# EAGLE design Power Supply Board (EAGLE 9.6.2)
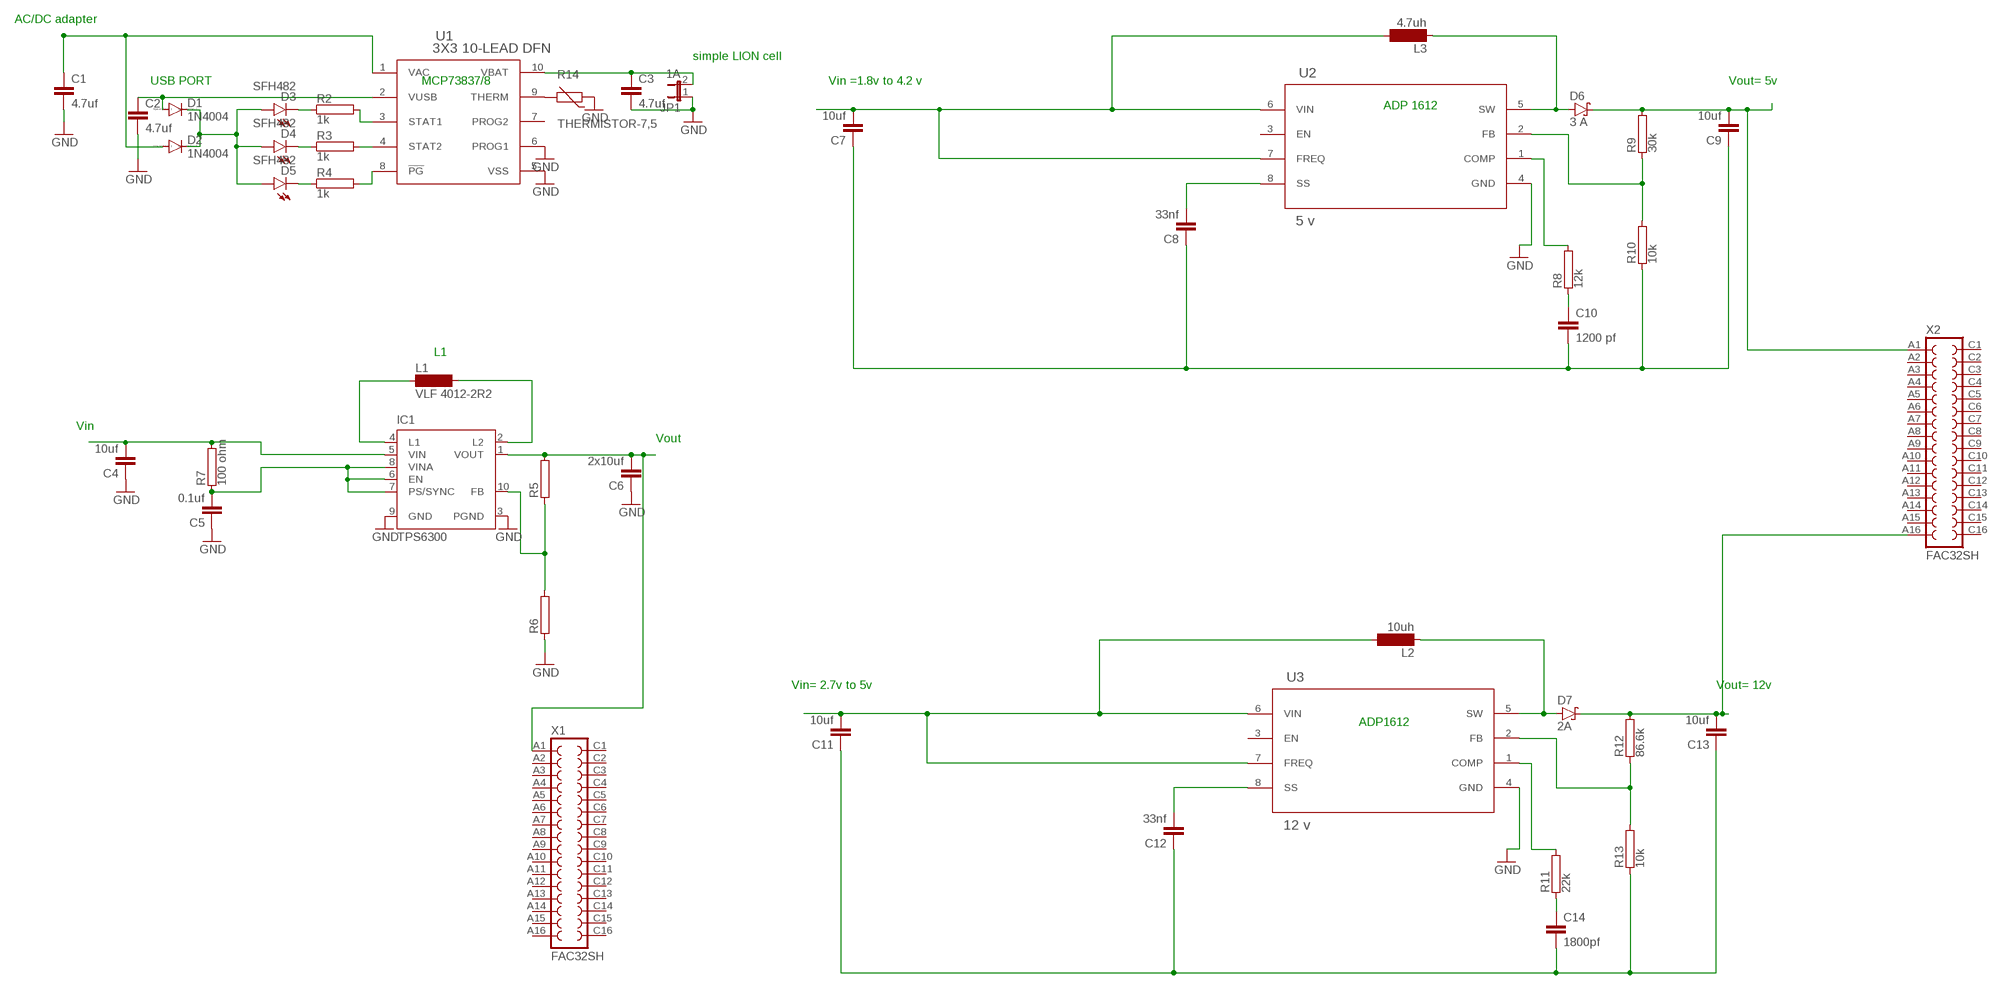
[diagram p0: schematic, sheet 1]

## Parts
C1  4.7uf  C2,5-3  [C2.5-3]
C2  4.7uf  C2,5-3  [C2.5-3]
C3  4.7uf  C2,5-3  [C2.5-3]
C4  10uf  C2,5-3  [C2.5-3]
C5  0.1uf  C2,5-3  [C2.5-3]
C6  2x10uf  C2,5-3  [C2.5-3]
C7  10uf  C2,5-3  [C2.5-3]
C8  33nf  C2,5-3  [C2.5-3]
C9  10uf  C2,5-3  [C2.5-3]
C10  1200 pf  C2,5-3  [C2.5-3]
C11  10uf  C2,5-3  [C2.5-3]
C12  33nf  C2,5-3  [C2.5-3]
C13  10uf  C2,5-3  [C2.5-3]
C14  1800pf  C2,5-3  [C2.5-3]
D1  1N4004  [DO41-10]
D2  1N4004  [DO41-10]
D3  SFH482  [SFH482]
D4  SFH482  [SFH482]
D5  SFH482  [SFH482]
D6  3 A  1N5908  [C4111-15]
D7  2A  1N5908  [C4111-15]
IC1  TPS6300  [DRC-S-PVSON-N10]
JP1  1A  JP1E  [JP1]
L1  VLF 4012-2R2  MS85  [MS85]
L2  10uh  MS42  [MS42]
L3  4.7uh  MS42  [MS42]
R2  1k  RAC01  [AC01]
R3  1k  RAC01  [AC01]
R4  1k  RAC01  [AC01]
R5  RAC01  [AC01]
R6  RAC01  [AC01]
R7  100 ohm  RAC01  [AC01]
R8  12k  RAC01  [AC01]
R9  30k  RAC01  [AC01]
R10  10k  RAC01  [AC01]
R11  22k  RAC01  [AC01]
R12  86.6k  RAC01  [AC01]
R13  10k  RAC01  [AC01]
R14  THERMISTOR-7,5  [R-7,5]
U1  3X3 10-LEAD DFN  MCP73837-FCI/UN  [MSOP10_MC_MCH]
U2  5 v  ADP1612  [RM_8_ADI]
U3  12 v  ADP1612  [RM_8_ADI]
X1  FAC32SH  [FAC32SH]
X2  FAC32SH  [FAC32SH]

## Nets
GND: C1.2 C2.2 C3.2 C4.1 C5.1 C6.1 IC1.3(PGND) IC1.9(GND) JP1.1 R6.1 R14.1 U1.5(VSS) U1.6(PROG1) U2.4(GND) U3.4(GND)
N$1: R14.2 U1.9(THERM)
N$2: C1.1 D2.A U1.1(VAC)
N$3: C2.1 D1.A U1.2(VUSB)
N$4: D1.C D2.C D3.A D4.A D5.A
N$5: C5.2 IC1.6(EN) IC1.7(PS/SYNC) IC1.8(VINA) R7.1
N$6: D3.K(C) R2.1
N$7: D4.K(C) R3.1
N$8: D5.K(C) R4.1
N$9: R2.2 U1.3(STAT1)
N$10: R3.2 U1.4(STAT2)
N$11: R4.2 U1.8(!PG)
N$12: C3.1 JP1.2 U1.10(VBAT)
N$13: C4.2 IC1.5(VIN) R7.2
N$14: IC1.4(L1) L1.1
N$15: IC1.2(L2) L1.2
N$16: C6.2 IC1.1(VOUT) R5.2 X1.A1
N$17: IC1.10(FB) R5.1 R6.2
N$18: C7.2 L3.2 U2.6(VIN) U2.7(FREQ)
N$19: D6.A L3.1 U2.5(SW)
N$20: C9.2 D6.C R9.2 X2.A1
N$21: R9.1 R10.2 U2.2(FB)
N$23: R8.2 U2.1(COMP)
N$24: C8.2 U2.8(SS)
N$25: C7.1 C8.1 C9.1 C10.2 R10.1
N$27: C10.1 R8.1
N$28: C11.2 L2.2 U3.6(VIN) U3.7(FREQ)
N$29: D7.A L2.1 U3.5(SW)
N$30: C13.2 D7.C R12.2 X2.A16
N$31: R12.1 R13.2 U3.2(FB)
N$32: R11.2 U3.1(COMP)
N$33: C12.2 U3.8(SS)
N$34: C11.1 C12.1 C13.1 C14.2 R13.1
N$35: C14.1 R11.1
Unconnected: IC1.TH U1.7(PROG2) U2.3(EN) U3.3(EN) X1.A2 X1.A3 X1.A4 X1.A5 X1.A6 X1.A7 X1.A8 X1.A9 X1.A10 X1.A11 X1.A12 X1.A13 X1.A14 X1.A15 X1.A16 X1.C1 X1.C2 X1.C3 X1.C4 X1.C5 X1.C6 X1.C7 X1.C8 X1.C9 X1.C10 X1.C11 X1.C12 X1.C13 X1.C14 X1.C15 X1.C16 X2.A2 X2.A3 X2.A4 X2.A5 X2.A6 X2.A7 X2.A8 X2.A9 X2.A10 X2.A11 X2.A12 X2.A13 X2.A14 X2.A15 X2.C1 X2.C2 X2.C3 X2.C4 X2.C5 X2.C6 X2.C7 X2.C8 X2.C9 X2.C10 X2.C11 X2.C12 X2.C13 X2.C14 X2.C15 X2.C16

## Notes on the sheet
- AC/DC adapter
- simple LION cell
- USB PORT | MCP73837/8 | Vin =1.8v to 4.2 v | Vout= 5v
- ADP 1612
- L1
- Vin
- Vout
- Vin= 2.7v to 5v | Vout= 12v
- ADP1612

## Library data of the parts
C1-C14 = capacitor-wima:C: CAPACITOR naming: grid - package width
D1 D2 = diode:1N4004: DIODE general purpose rectifier, 1 A
D3-D5 = led:SFH482: IR LED infrared emitting diode, Infineon
D6 D7 = diode:1N5908: DIODE schottky
IC1 = texas:TPS6300*: HIGH EFFICIENT SINGLE INDUCTOR BUCK-BOOST CONVERTER WITH 1.8-A SWITCHES Source: http://focus.ti.com/lit/ds/symlink/tps63001.pdf; MPN: TPS63000DRCTG4; OC_FARNELL: 1511852; OC_NEWARK: 59M7217
JP1 = jumper:JP1E: JUMPER
L1 = inductor-neosid:MS85: INDUCTOR SMD power inductor; OC_FARNELL: unknown; OC_NEWARK: unknown
L2 L3 = inductor-neosid:MS42: INDUCTOR SMD inductor; OC_FARNELL: unknown; OC_NEWARK: unknown
R2-R13 = resistor-power:R: Power Resitor; OC_FARNELL: unknown; OC_NEWARK: unknown
R14 = varistor:THERMISTOR: THERMISTOR
U1 = ultra librarian:MCP73837-FCI/UN: MCP73837 Battery charge controller , MCP 73837 - Li-Ion/Li-Polymer Battery Charge Management Controller; BUILT_BY: EMA_UL_Team; MANUFACTURER_PART_NUMBER: MCP73837-FCI/UN; SOURCELIBRARY: Microchip_2011-05-13; VENDOR: Microchip
U2 U3 = ultra librarian:ADP1612: ADP 1612/1613 , ADP 1612, ADP1613, DC - DC step up converter; BUILT_BY: EMA_UL_Team; MANUFACTURER_PART_NUMBER: ADP1612ARMZ-R7; SOURCELIBRARY: Analog_2015-12-15; VENDOR: Analog Devices Inc
X1 X2 = con-vg:FAC32SH: CONNECTOR female, 32 pins, block, type B, rows AC, grid 5.08 mm

## Board
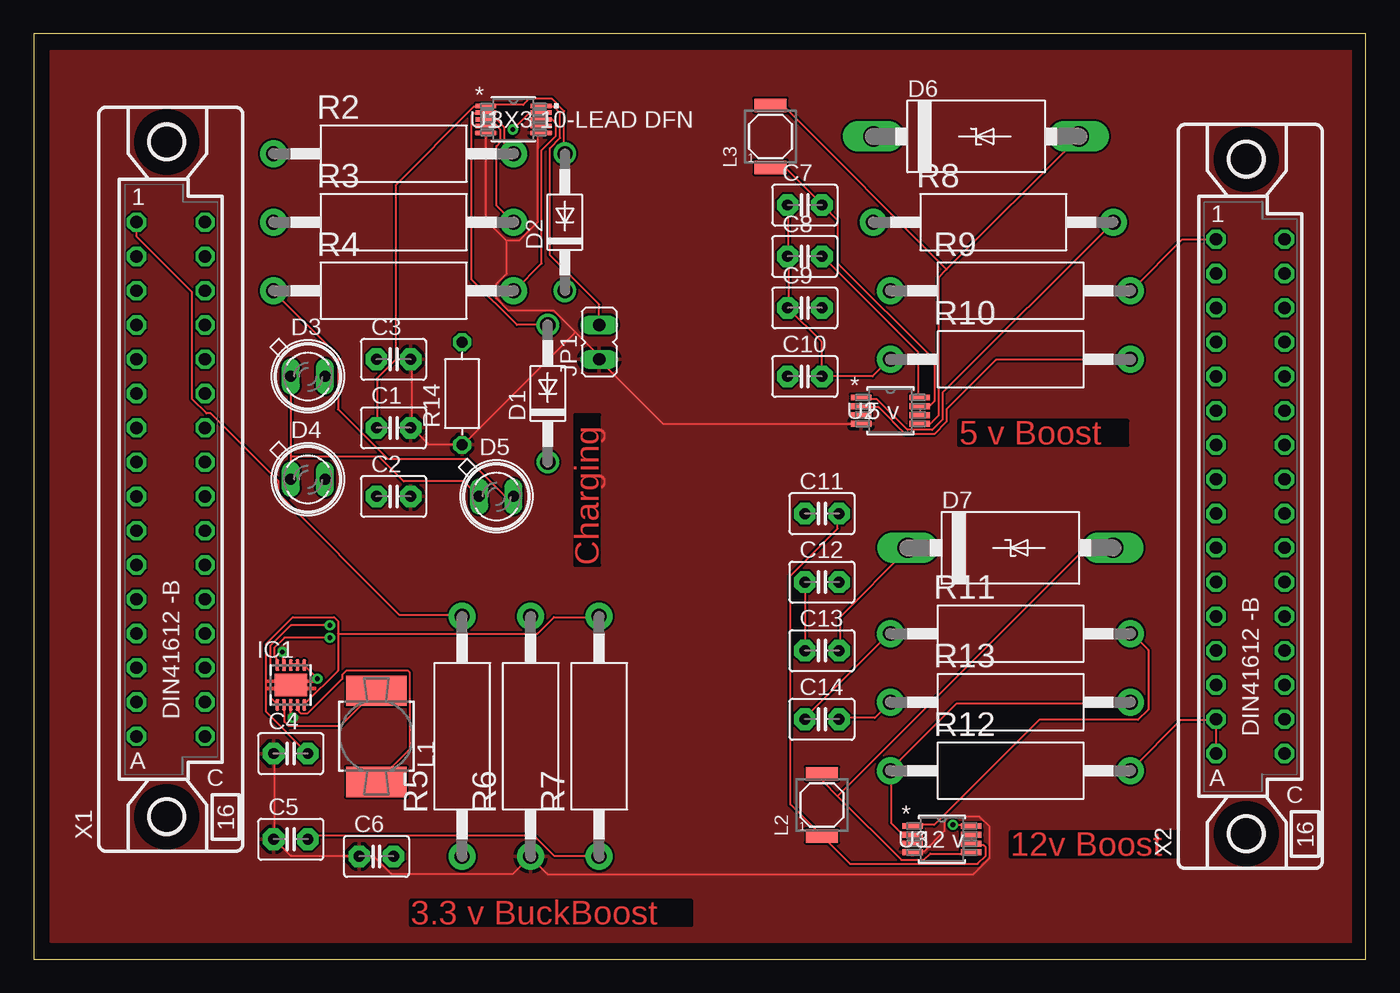
[diagram p1: board, top side]
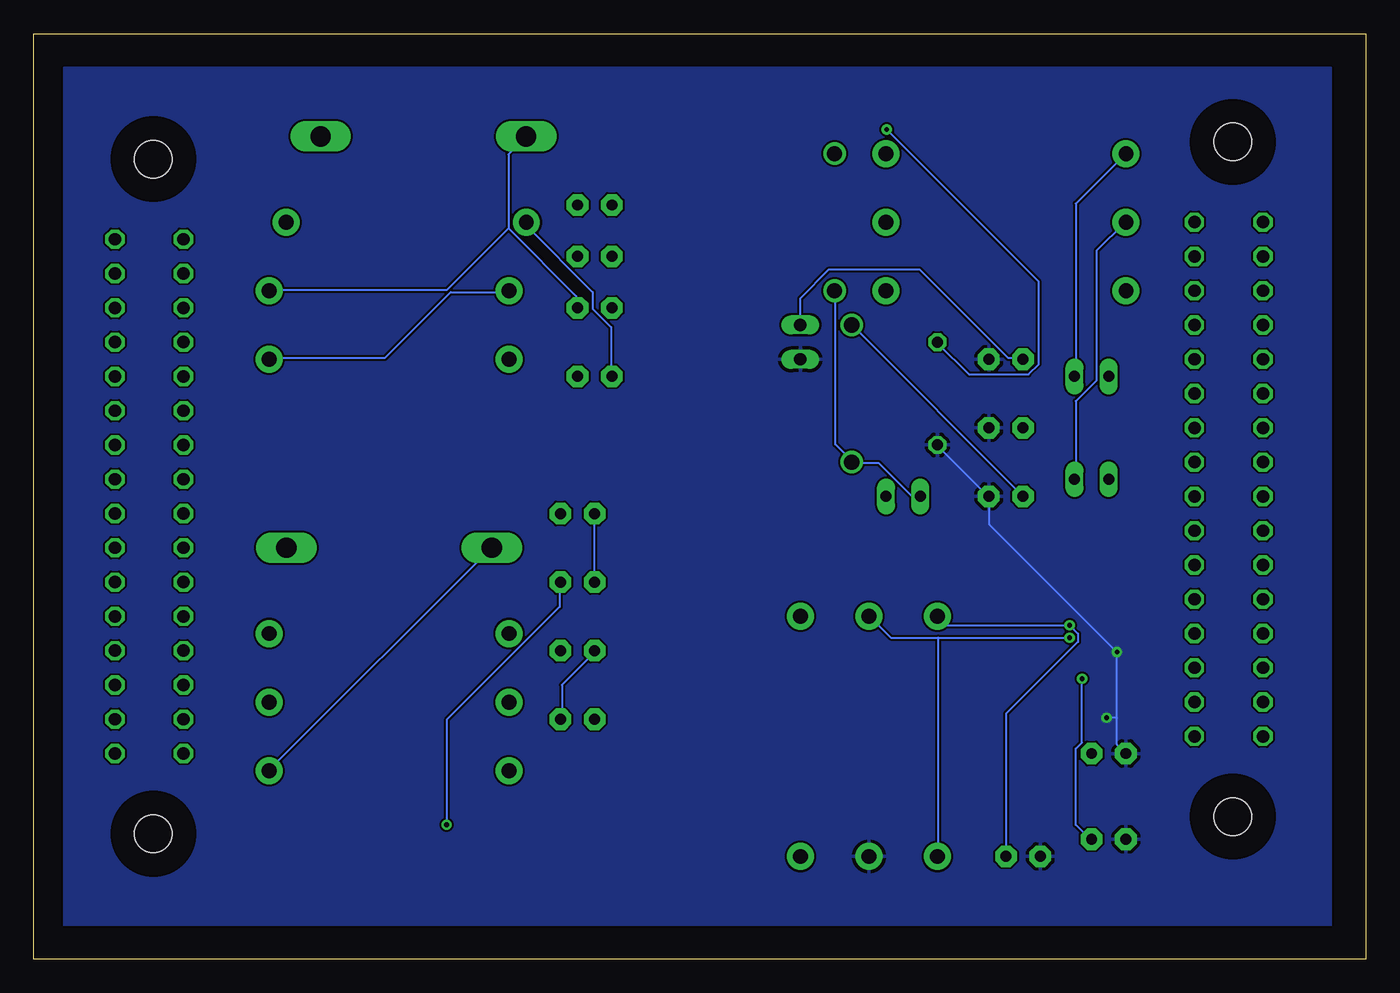
[diagram p2: board, bottom side, seen from below]

Size 98.73 x 68.57 mm. Coordinates in mm from the lower left corner, seen from the top.
Outline: 0,0 98.73,0 98.73,68.57 0,68.57 0,0
Copper layers (1*16): Top 0.035mm / dielectric 1.5mm / Bottom 0.035mm
Design rules "default": minimum track width 6mil, minimum drill 0.35mm, track to track 6mil, track to pad 6mil, pad to pad 6mil, via to via 6mil, smd to smd 6mil, copper to edge 40mil, drill to drill 6mil, minimum pad ring 10mil, minimum via ring 8mil, stop-mask expansion 4mil, vias tented up to drill 0mil, thermal gap 10mil

### Footprints (pad centres in the part's own frame; a part is rotated, then mirrored left to right if it is on the bottom)
C2.5-3 = drill 0.813 pad 1.6 octagon: 1 -1.27,0; 2 1.27,0
DO41-10 = drill 1.118: A 5.08,0; C -5.08,0
SFH482 = drill 0.813 long: A -1.27,0; K 1.27,0
C4111-15 = drill 1.499 long: A 7.62,0; C -7.62,0
DRC-S-PVSON-N10 = smd 0.28 x 0.85: 1 -1,-1.475; 2 -0.5,-1.475; 3 0,-1.475; 4 0.5,-1.475; 5 1,-1.475; 6 1,1.475; 7 0.5,1.475; 8 0,1.475; 9 -0.5,1.475; 10 -1,1.475 | smd 2.4 x 1.65: TH 0,0
JP1 = drill 0.914 long: 1 0,-1.27; 2 0,1.27
MS85 = smd 4.5 x 2.25: 1 0,-3.383; 2 0,3.383
MS42 = smd 2.4 x 1: 1 0,2.3; 2 0,-2.3
AC01 = drill 1.1 pad 2: 1 -8.9,0; 2 8.9,0
R-7,5 = drill 0.813 octagon: 1 -3.81,0; 2 3.81,0
MSOP10_MC_MCH = smd 1.524 x 0.33: 1 -2.045,1; 2 -2.045,0.5; 3 -2.045,0; 4 -2.045,-0.5; 5 -2.045,-1; 6 2.045,-1; 7 2.045,-0.5; 8 2.045,0; 9 2.045,0.5; 10 2.045,1
RM_8_ADI = smd 1.524 x 0.432: 1 -2.172,0.975; 2 -2.172,0.325; 3 -2.172,-0.325; 4 -2.172,-0.975; 5 2.172,-0.975; 6 2.172,-0.325; 7 2.172,0.325; 8 2.172,0.975
FAC32SH = drill 0.914 octagon: A1 -2.54,19.05; A2 -2.54,16.51; A3 -2.54,13.97; A4 -2.54,11.43; A5 -2.54,8.89; A6 -2.54,6.35; A7 -2.54,3.81; A8 -2.54,1.27; A9 -2.54,-1.27; A10 -2.54,-3.81; A11 -2.54,-6.35; A12 -2.54,-8.89; A13 -2.54,-11.43; A14 -2.54,-13.97; A15 -2.54,-16.51; A16 -2.54,-19.05; C1 2.54,19.05; C2 2.54,16.51; C3 2.54,13.97; C4 2.54,11.43; C5 2.54,8.89; C6 2.54,6.35; C7 2.54,3.81; C8 2.54,1.27; C9 2.54,-1.27; C10 2.54,-3.81; C11 2.54,-6.35; C12 2.54,-8.89; C13 2.54,-11.43; C14 2.54,-13.97; C15 2.54,-16.51; C16 2.54,-19.05 | hole 2.794: -0.305,24.994; -0.305,-24.994

### Placement (x,y rotation side)
C1  26.67,39.37 0 top
C2  26.67,34.29 0 top
C3  26.67,44.45 0 top
C4  19.05,15.24 0 top
C5  19.05,8.89 0 top
C6  25.4,7.62 0 top
C7  57.15,55.88 0 top
C8  57.15,52.07 0 top
C9  57.15,48.26 0 top
C10  57.15,43.18 0 top
C11  58.42,33.02 0 top
C12  58.42,27.94 0 top
C13  58.42,22.86 0 top
C14  58.42,17.78 0 top
D1  38.1,41.91 90 top
D2  39.37,54.61 90 top
D3  20.32,43.18 0 top
D4  20.32,35.56 0 top
D5  34.29,34.29 0 top
D6  69.85,60.96 0 top
D7  72.39,30.48 0 top
IC1  19.05,20.32 0 top
JP1  41.91,45.72 0 top
L1  25.4,16.51 0 top
L2  58.42,11.43 0 top
L3  54.61,60.96 0 top
R2  26.67,59.69 0 top
R3  26.67,54.61 0 top
R4  26.67,49.53 0 top
R5  31.75,16.51 90 top
R6  36.83,16.51 90 top
R7  41.91,16.51 90 top
R8  71.12,54.61 0 top
R9  72.39,49.53 0 top
R10  72.39,44.45 0 top
R11  72.39,24.13 0 top
R12  72.39,13.97 0 top
R13  72.39,19.05 0 top
R14  31.75,41.91 90 top
U1  35.56,62.23 0 top
U2  63.5,40.64 0 top
U3  67.31,8.89 0 top
X1  10.16,35.56 0 top
X2  90.17,34.29 0 top

### Tracks (layer width: path | path; a pad name or v marks a point on that pad's centre or on a via)
GND  (via drill 0.35)
  Top 0.152: 28.04,39.37 29.26,38.15 31.7,38.15 R14.1 31.85,38.15 40.08,46.38 40.08,46.53 | 28.04,39.37 28.04,44.4 C3.2 | 28.04,39.37 C1.2 | 35.05,53.24 33.53,54.76 33.53,61.16 U1.5 | 35.05,53.24 35.97,53.24 37.34,54.61 37.34,61.01 37.49,61.16 U1.6 | U2.4 61.27,39.67 46.63,39.67 41.91,44.4 JP1.1 41.91,44.7 40.08,46.53 | 35.05,53.24 35.05,50.8 34.29,50.04 34.29,48.97 35.2,48.06 38.56,48.06 40.08,46.53 | v18.44,22.76 18.44,21.84 IC1.9 | IC1.3 19.05,18.03 v19.2,17.88 | 17.83,8.89 17.83,15.14 C4.1 | 17.83,8.89 19.05,7.67 24.08,7.67 C6.1 24.23,7.52 25.3,7.52 26.52,6.3 35.51,6.3 36.73,7.52 R6.1 36.88,7.52 38.1,6.3 69.65,6.3 70.87,7.52 70.87,9.8 70.1,10.57 67.82,10.57 67.51,10.26 67.51,9.5 65.99,7.98 65.23,7.98 U3.4 | 17.83,8.89 C5.1
  Bottom 0.152: R14.1 31.7,38 28.04,34.34 C2.2 27.89,34.19 27.89,32.21 v18.44,22.76 18.44,17.88 | 18.44,17.88 18.44,15.9 C4.1 | 18.44,17.88 v19.2,17.88
  pour Bottom: 2.54,66.04 96.52,66.04 96.52,2.54 93.98,2.54 2.54,2.54 2.54,3.81
  pour Top: 1.27,67.31 97.79,67.31 97.79,1.27 96.52,1.27 1.27,1.27 1.27,2.54
N$1  (via drill 0.35)
  Top 0.152: v35.51,61.47 36.73,62.69 37.49,62.69 U1.9
  Bottom 0.152: v35.51,61.47 24.23,50.19 24.23,44.09 24.99,43.33 29.41,43.33 31.7,45.62 R14.2
N$2
  Top 0.152: D2.A 39.32,59.79 39.32,62.84 38.41,63.75 36.73,63.75 36.27,63.3 33.53,63.3 U1.1 33.38,63.14 32.61,63.14 26.82,57.35 26.82,44.4 25.45,43.03 25.45,39.37 C1.1
N$3
  Top 0.152: D1.A 35.81,46.99 32.46,50.34 32.46,62.54 32.61,62.69 33.38,62.69 U1.2
  Bottom 0.152: D1.A C2.1
N$4
  Top 0.152: D3.A 19.05,37.24 | 19.05,37.24 D4.A | 19.05,37.24 25.6,37.24 27.43,35.41 31.85,35.41 32.92,34.34 D5.A
  Bottom 0.152: D5.A 33.07,34.34 33.68,34.34 36.12,36.78 38.1,36.78 D1.C 38.1,36.93 39.32,38.15 39.32,49.43 D2.C
N$5  (via drill 0.35)
  Top 0.152: IC1.8 19.05,21.84 19.51,21.84 IC1.7 19.66,21.84 19.96,21.84 IC1.6 20.12,21.69 v21.03,20.78 | R7.1 41.91,7.67 38.56,7.67 37.03,9.2 20.73,9.2 20.42,8.89 C5.2
  Bottom 0.152: v21.03,20.78 21.03,16.05 21.49,15.6 21.49,9.96 20.42,8.89 C5.2
N$6
  Bottom 0.152: D3.K 21.49,43.18 21.49,55.98 17.83,59.64 R2.1
N$7
  Bottom 0.152: D4.K 21.49,35.56 21.49,41.35 19.96,42.88 19.96,52.48 17.83,54.61 R3.1
N$8
  Top 0.152: D5.K 35.51,34.34 34.9,34.34 32.16,37.08 26.21,37.08 22.55,40.74 22.55,44.7 17.83,49.43 R4.1
N$9
  Top 0.152: U1.3 34.29,62.23 34.9,61.62 34.9,60.4 35.51,59.79 R2.2
N$10
  Top 0.152: U1.4 33.53,61.77 34.29,61.77 34.59,61.47 34.59,60.55 34.29,60.25 34.29,55.83 35.51,54.61 R3.2
N$11
  Top 0.152: U1.8 38.41,62.23 38.71,61.93 38.71,61.01 37.64,59.94 37.64,51.56 35.66,49.58 R4.2
N$12
  Top 0.152: JP1.2 41.91,48.51 38.25,52.17 38.25,60.1 39.01,60.86 39.01,62.69 38.56,63.14 37.64,63.14 U1.10
  Bottom 0.152: JP1.2 41.91,48.97 39.78,51.1 33.07,51.1 26.52,44.55 25.45,44.55 C3.1
N$13
  Top 0.152: 22.55,24.13 22.55,25.04 22.25,25.35 19.2,25.35 17.22,23.37 17.22,18.34 C4.2 | 22.55,24.13 22.55,21.39 20.12,18.95 IC1.5 | 22.55,24.13 37.34,24.13 38.56,25.35 41.91,25.35 R7.2
N$14
  Top 0.152: IC1.4 19.66,18.8 19.66,18.34 19.81,18.19 20.27,18.19 22.86,20.78 22.86,21.08 23.16,21.39 27.74,21.39 27.89,21.23 27.89,15.6 25.45,13.16 L1.1
N$15
  Top 0.152: IC1.2 18.59,18.8 18.59,17.58 18.9,17.27 22.71,17.27 25.3,19.86 L1.2
N$16  (via drill 0.35)
  Top 0.152: v21.95,24.74 19.05,24.74 17.53,23.22 17.53,19.41 17.98,18.95 IC1.1 | X1.A1 7.62,53.54 11.73,49.43 11.73,41.5 12.8,40.44 13.11,40.44 18.14,35.41 18.14,34.49 27.13,25.5 31.7,25.5 R5.2
  Bottom 0.152: R5.2 31.7,25.35 31.09,24.74 v21.95,24.74 21.34,24.13 21.34,23.52 26.67,18.19 C6.2
N$17  (via drill 0.35)
  Top 0.152: v21.95,23.83 18.59,23.83 17.83,23.06 17.83,22.45 17.98,22.3 17.98,21.84 IC1.10
  Bottom 0.152: 31.7,23.83 35.2,23.83 36.73,25.35 R6.2 | 31.7,23.83 v21.95,23.83 | 31.7,23.83 31.7,7.67 R5.1
N$18
  Top 0.152: U2.6 65.68,40.44 65.68,40.89 U2.7 65.68,41.05 66.45,41.05 66.75,41.35 66.75,44.4 59.59,51.56 59.59,54.76 58.52,55.83 C7.2 58.37,55.98 55.78,58.57 54.71,58.57 L3.2
N$19
  Top 0.152: 67.67,51.1 77.42,60.86 D6.A | 67.67,51.1 67.06,50.49 67.06,40.28 66.45,39.67 65.68,39.67 U2.5 | 67.67,51.1 55.63,63.14 54.71,63.14 L3.1
N$20
  Top 0.152: X2.A1 85.14,53.34 81.38,49.58 R9.2
  Bottom 0.152: 63.55,54.15 58.52,49.12 58.52,48.36 C9.2 | 63.55,54.15 63.55,59.64 D6.C | 63.55,54.15 68.12,49.58 81.23,49.58 R9.2
N$21
  Top 0.152: U2.2 61.42,40.89 62.64,40.89 64.62,38.91 66.75,38.91 67.67,39.83 67.67,40.74 71.32,44.4 81.23,44.4 R10.2
  Bottom 0.152: R9.1 63.55,49.43 67.82,49.43 72.69,44.55 81.23,44.55 R10.2
N$23
  Top 0.152: U2.1 61.42,41.5 62.48,41.5 64.77,39.22 66.6,39.22 67.36,39.98 67.36,41.96 R8.2
N$24
  Top 0.152: U2.8 65.53,41.66 65.53,45.01 58.52,52.02 C8.2
N$25
  Top 0.152: R10.1 63.4,44.4 62.18,43.18 C10.2 58.37,43.18 58.37,45.77 C9.1 55.93,48.36 55.93,52.02 C8.1 55.93,52.17 55.93,55.83 C7.1
N$27
  Bottom 0.152: C10.1 55.93,43.18 55.93,46.84 57.3,48.21 57.3,49.43 62.18,54.3 62.18,54.61 R8.1
N$28
  Top 0.152: U3.7 69.49,9.2 69.49,8.59 U3.6 69.49,8.43 70.41,8.43 70.56,8.28 70.56,7.67 69.95,7.06 60.5,7.06 58.52,9.04 L2.2 58.37,9.2 56.08,11.48 56.08,28.4 59.59,31.9 59.59,32.97 C11.2
N$29
  Top 0.152: 59.59,12.09 58.52,13.16 58.52,13.61 L2.1 | 59.59,12.09 64.31,7.37 65.99,7.37 66.45,7.82 69.34,7.82 U3.5 | 59.59,12.09 77.88,30.38 80.01,30.38 D7.A
N$30
  Top 0.152: X2.A16 87.63,17.73 85.04,17.73 81.38,14.07 R12.2 | C13.2 59.74,22.91 59.74,25.35 64.77,30.38 D7.C
  Bottom 0.152: R12.2 81.23,14.07 64.77,30.53 D7.C
N$31
  Top 0.152: U3.2 65.08,9.35 64.31,9.35 63.55,10.11 63.55,13.92 R12.1 63.55,14.07 68.43,18.95 81.23,18.95 R13.2
N$32
  Top 0.152: U3.1 65.23,9.96 66.75,9.96 74.52,17.73 81.84,17.73 82.6,18.49 82.6,22.91 81.38,24.13 R11.2
N$33  (via drill 0.35)
  Top 0.152: v68.12,9.96 69.34,9.96 U3.8
  Bottom 0.152: v68.12,9.96 68.12,17.73 59.74,26.11 59.74,27.94 C12.2
N$34
  Top 0.152: C14.2 59.74,17.88 62.33,17.88 63.4,18.95 R13.1 | C12.1 C13.1
  Bottom 0.152: C12.1 C11.1 | C14.2 59.59,17.88 59.59,20.32 57.15,22.76 C13.1
N$35
  Top 0.152: C14.1 57.15,17.88 63.4,24.13 R11.1

### Text on the board
Top: 5 v Boost | Charging | 12v Boost | 3.3 v BuckBoost